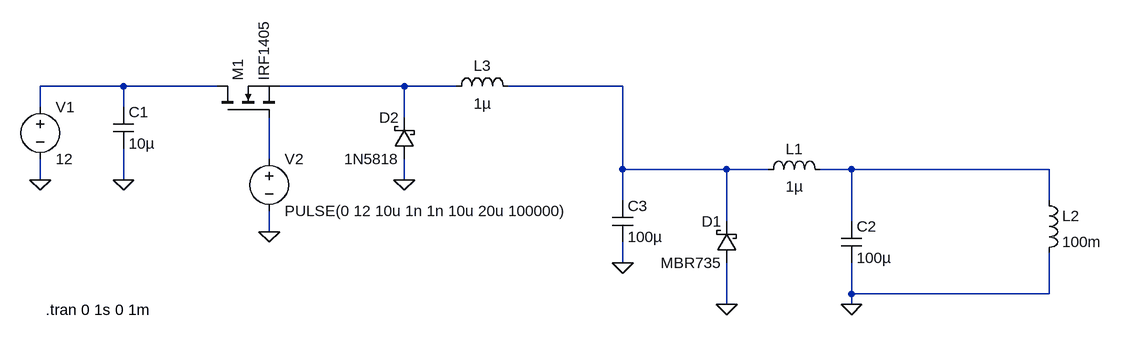
[diagram p0: schematic SwitchingPS.asc]
SwitchingPS.asc, the LTspice schematic file:
Version 4
SHEET 1 1076 680
WIRE -464 48 -592 48
WIRE -320 48 -464 48
WIRE -32 48 -224 48
WIRE 48 48 -32 48
WIRE 304 48 128 48
WIRE -592 80 -592 48
WIRE -464 80 -464 48
WIRE -32 96 -32 48
WIRE -240 160 -240 96
WIRE 304 176 304 48
WIRE 464 176 304 176
WIRE 528 176 464 176
WIRE 656 176 608 176
WIRE 960 176 656 176
WIRE -592 192 -592 160
WIRE -464 192 -464 144
WIRE -32 192 -32 160
WIRE 304 224 304 176
WIRE 960 224 960 176
WIRE 464 256 464 176
WIRE 656 256 656 176
WIRE -240 272 -240 240
WIRE 304 320 304 288
WIRE 656 368 656 320
WIRE 960 368 960 304
WIRE 960 368 656 368
WIRE 464 384 464 320
WIRE 656 384 656 368
FLAG -592 192 0
FLAG -464 192 0
FLAG -240 272 0
FLAG 464 384 0
FLAG 656 384 0
FLAG 304 320 0
FLAG -32 192 0
SYMBOL nmos -320 96 R270
SYMATTR InstName M1
SYMATTR Value IRF1405
SYMBOL cap -480 80 R0
SYMATTR InstName C1
SYMATTR Value 10µ
SYMBOL voltage -592 64 R0
WINDOW 123 0 0 Left 2
WINDOW 39 0 0 Left 2
SYMATTR InstName V1
SYMATTR Value 12
SYMBOL voltage -240 144 R0
WINDOW 123 0 0 Left 2
WINDOW 39 0 0 Left 2
SYMATTR InstName V2
SYMATTR Value PULSE(0 12 10u 1n 1n 10u 20u 100000)
SYMBOL schottky 480 320 R180
WINDOW 0 24 64 Left 2
WINDOW 3 24 0 Left 2
SYMATTR InstName D1
SYMATTR Value MBR735
SYMATTR Description Diode
SYMATTR Type diode
SYMBOL cap 640 256 R0
SYMATTR InstName C2
SYMATTR Value 100µ
SYMBOL ind 512 192 R270
WINDOW 0 32 56 VTop 2
WINDOW 3 5 56 VBottom 2
SYMATTR InstName L1
SYMATTR Value 1µ
SYMBOL cap 288 224 R0
SYMATTR InstName C3
SYMATTR Value 100µ
SYMBOL ind 944 208 R0
SYMATTR InstName L2
SYMATTR Value 100m
SYMBOL ind 32 64 R270
WINDOW 0 32 56 VTop 2
WINDOW 3 5 56 VBottom 2
SYMATTR InstName L3
SYMATTR Value 1µ
SYMBOL schottky -16 160 R180
WINDOW 0 24 64 Left 2
WINDOW 3 24 0 Left 2
SYMATTR InstName D2
SYMATTR Value 1N5818
SYMATTR Description Diode
SYMATTR Type diode
TEXT -584 392 Left 2 !.tran 0 1s 0 1m

The netlist it stands for:
* SwitchingPS.asc
M1 N001 N004 N002 N002 IRF1405
C1 N001 0 10µ
V1 N001 0 12
V2 N004 0 PULSE(0 12 10u 1n 1n 10u 20u 100000)
D1 0 N003 MBR735
C2 N005 0 100µ
L1 N003 N005 1µ
C3 N003 0 100µ
L2 N005 0 100m
L3 N002 N003 1µ
D2 0 N002 1N5818
.model D D
.lib standard.dio
.model NMOS NMOS
.model PMOS PMOS
.lib standard.mos
.tran 0 1s 0 1m
.backanno
.end